# Altium schematic sheet sdc_Sch.SchDoc
size A4
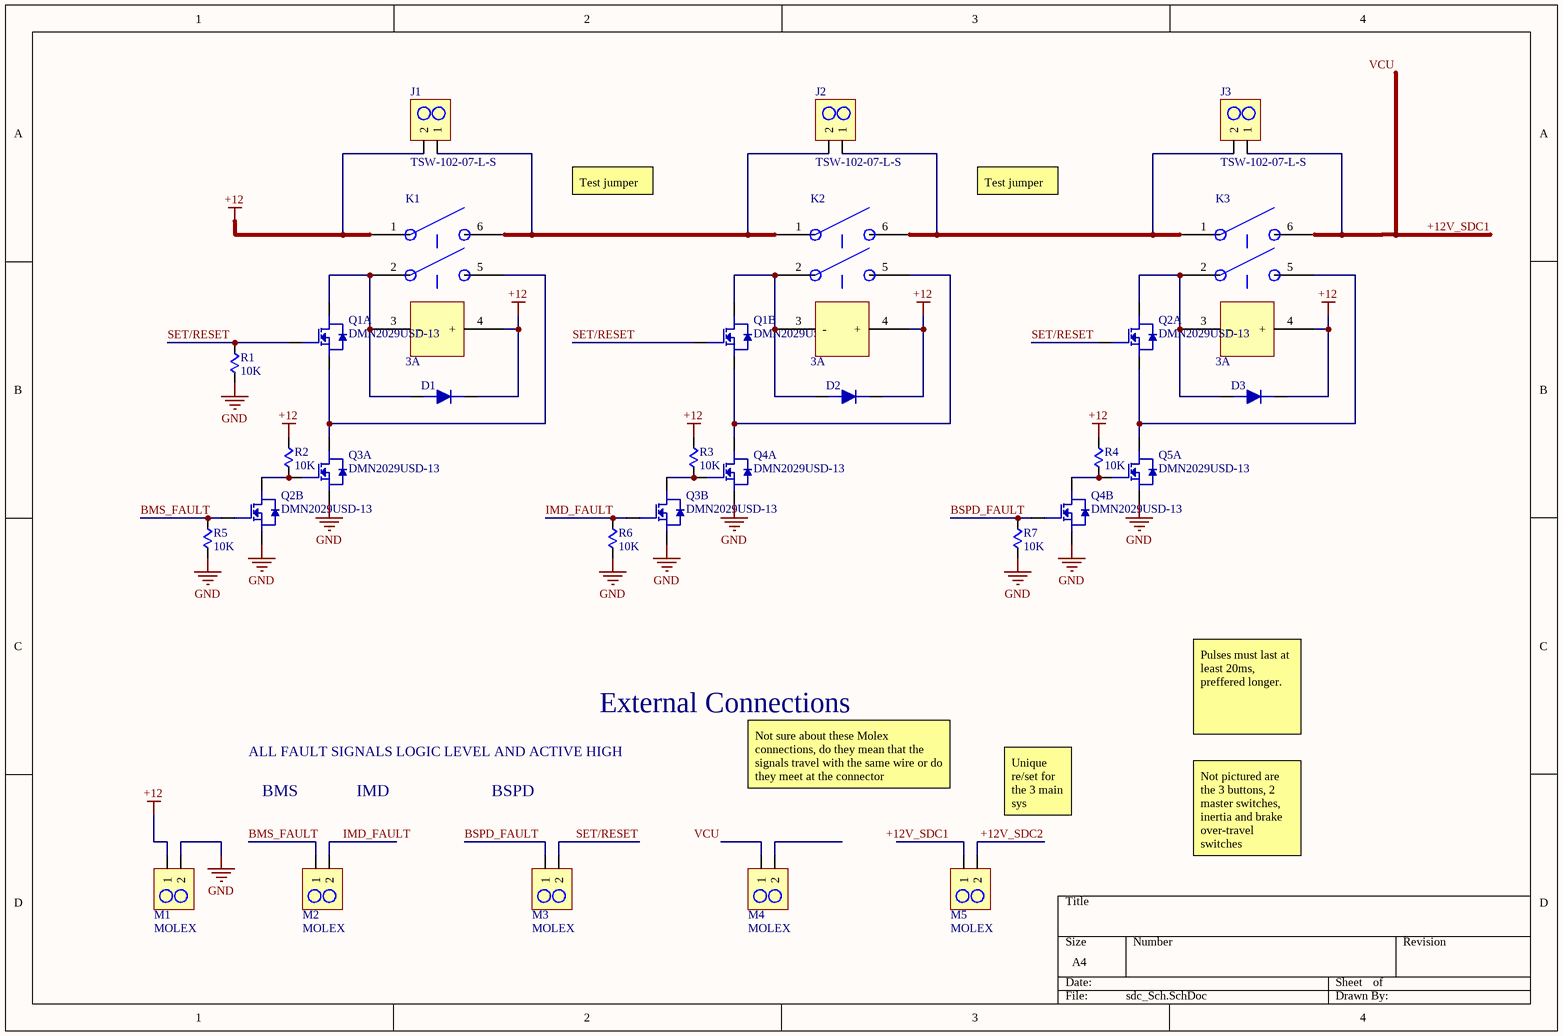
[diagram p0: sdc_Sch.SchDoc]

## Parts
D1  SD560BTR  [DIOM4436X26N]  (value not drawn)
D2  SD560BTR  [DIOM4436X26N]  (value not drawn)
D3  SD560BTR  [DIOM4436X26N]  (value not drawn)
J1  TSW-102-07-L-S  [TSW-102-XX-X-S]
J2  TSW-102-07-L-S  [TSW-102-XX-X-S]
J3  TSW-102-07-L-S  [TSW-102-XX-X-S]
K1  3A  [RELAY02_FOOTPRINT]
K2  3A  [RELAY02_FOOTPRINT]
K3  3A  [RELAY02_FOOTPRINT]
M1  MOLEX  [MOLEX 1]
M2  MOLEX  [MOLEX 1]
M3  MOLEX  [MOLEX 1]
M4  MOLEX  [MOLEX 1]
M5  MOLEX  [MOLEX 1]
Q1  DMN2029USD-13  [SOIC127P600X175-8N]  (parts A,B of 2)
Q2  DMN2029USD-13  [SOIC127P600X175-8N]  (parts A,B of 2)
Q3  DMN2029USD-13  [SOIC127P600X175-8N]  (parts A,B of 2)
Q4  DMN2029USD-13  [SOIC127P600X175-8N]  (parts A,B of 2)
Q5  DMN2029USD-13  [SOIC127P600X175-8N]  (part A of 2)
R1  10K  [10KOHM]
R2  10K  [10KOHM]
R3  10K  [10KOHM]
R4  10K  [10KOHM]
R5  10K  [10KOHM]
R6  10K  [10KOHM]
R7  10K  [10KOHM]

## Nets
+12: D1.2 D2.2 D3.2 J1.2 K1.1 K1.4(+) K2.4(+) K3.4(+) M1.1 R2.1 R3.1 R4.1
GND: M1.2 Q2.3(S2) Q3.1(S1) Q3.3(S2) Q4.1(S1) Q4.3(S2) Q5.1(S1) R1.2 R5.2 R6.2 R7.2
+12V_SDC1: J3.1 K3.6 M4.1 M5.1  [also labelled VCU]
+12V_SDC2: M5.2
BMS_FAULT: M2.1 Q2.4(G2) R5.1
BSPD_FAULT: M3.1 Q4.4(G2) R7.1
IMD_FAULT: M2.2 Q3.4(G2) R6.1
SET/RESET: M3.2 Q1.2(G1) Q1.4(G2) Q2.2(G1) R1.1
NetD1_1: D1.1 K1.2 K1.3(-) Q1.8(D1)
NetD2_1: D2.1 K2.2 K2.3(-) Q1.5(D2)
NetD3_1: D3.1 K3.2 K3.3(-) Q2.8(D1)
NetJ1_1: J1.1 J2.2 K1.6 K2.1
NetJ2_1: J2.1 J3.2 K2.6 K3.1
NetK1_5: K1.5 Q1.1(S1) Q3.8(D1)
NetK2_5: K2.5 Q1.3(S2) Q4.8(D1)
NetK3_5: K3.5 Q2.1(S1) Q5.8(D1)
NetQ2_5: Q2.5(D2) Q3.2(G1) R2.2
NetQ3_5: Q3.5(D2) Q4.2(G1) R3.2
NetQ4_5: Q4.5(D2) Q5.2(G1) R4.2

Not connected (* = marked no-connect by the designer): M4 2

## Notes on the sheet
- Test jumper
- External Connections
- ALL FAULT SIGNALS LOGIC LEVEL AND ACTIVE HIGH
- Not sure about these Molex connections, do they mean that the signals travel with the same wire or do they meet at the connector
- Pulses must last at least 20ms, preffered longer.
- BMS
- IMD
- BSPD
- Unique re/set for the 3 main sys
- Not pictured are the 3 buttons, 2 master switches, inertia and brake over-travel switches

## Library data of the parts
D1-D3 = SD560BTR: DIODE GEN PURP 600V 5A SMB; Manufacturer: SMC; Supplier 1: Digi-Key; Manufacturer Part Number: SD560BTR; Stock 1: 109105; Pricing 1: 1=0.5, 10=0.358, 100=0.2106, 500=0.11922, 1000=0.0914 (USD); Mount: Surface Mount; Case/Package: SMB; Packaging: Tape and Reel; Max Reverse Voltage (DC): 600V; Average Rectified Current: 5A; Supplier Part Number 1: 1655-1530-1-ND
J1-J3 = TSW-102-07-L-S: CONN HEADER VERT 2POS 2.54MM; Manufacturer: Samtec; Max Current Rating: 7.6A; Number of Positions: 2; Max Voltage Rating (AC): 550V; Gender: Male; Connector Type: Male Pin; Supplier 1: Digi-Key; Manufacturer Part Number: TSW-102-07-L-S; Stock 1: 176; Pricing 1: 1=0.22, 10=0.211, 25=0.1796, 50=0.1572, 100=0.146, 250=0.12916, 500=0.12356 (USD); Mount: Through Hole; Contact Material: Bronze; Contact Plating: Gold; Color: Black; Housing Color: Black; Housing Material: Polyester; Min Operating Temperature: -55°C; Max Operating Temperature: 125°C; Number of Rows: 1; Packaging: Bulk; Termination: Solder; Number of Contacts: 2; Orientation: Straight; Current Rating: 7.6A; Voltage Rating: 550V; Package Quantity: 1; Length: 5.08mm; Pitch: 2.54mm; Contact Mating Length: 0.23inch; Depth: 2.54mm; Width: 2.54mm; Radiation Hardening: No; REACH SVHC: No SVHC; Lead Free: Lead Free; ComponentLink1URL: http://suddendocs.samtec.com/prints/tsw-xxx-xx-x-x-xx-xxx-footprint.pdf?src-supplier=Avnet; ComponentLink1Description: http://suddendocs.samtec.com/prints/tsw-xxx-xx-x-x-xx-xxx-footprint.pdf?src-supplier=Avnet; ComponentLink2URL: http://suddendocs.samtec.com/prints/tsw-xxx-xx-x-x-xx-xxx-footprint.pdf?src-supplier=Avnet+Europe; ComponentLink2Description: http://suddendocs.samtec.com/prints/tsw-xxx-xx-x-x-xx-xxx-footprint.pdf?src-supplier=Avnet+Europe; ComponentLink3URL: http://suddendocs.samtec.com/prints/tsw-xxx-xx-x-x-xx-xxx-footprint.pdf?src-supplier=Digi-Key; ComponentLink3Description: http://suddendocs.samtec.com/prints/tsw-xxx-xx-x-x-xx-xxx-footprint.pdf?src-supplier=Digi-Key; ComponentLink4URL: http://www.farnell.com/datasheets/1596380.pdf?src-supplier=Element14; ComponentLink4Description: http://www.farnell.com/datasheets/1596380.pdf?src-supplier=Element14; Supplier Part Number 1: SAM1031-02-ND
K1-K3 = OSA-SS-212DM3,000: RELAY TE CONNECTIVITY / OEG         OSA-SS-212DM3,000             General Purpose Relay, OSA Series, Power, Non Latching, DPST-NO, 12 VDC, 3 A; Coil Current: 45mA; Throw Configuration: DPST; Operate Time: 20ms; Release Time: 10ms; Coil Power: 600mW; Coil Resistance: 270R; Coil Type: Non-Latching; Coil Voltage (DC): 12V; Contact Voltage Rating (AC): 240V; Supplier 1: Digi-Key; Supplier Part Number 1: OSA-SS-212DM3,000-ND; Manufacturer: TE Connectivity; Manufacturer Part Number: OSA-SS-212DM3,000; Stock 1: 2623; Pricing 1: 1=2.54, 10=2.385, 25=2.1204, 50=2.0142, 100=1.9083, 250=1.69624, 500=1.59022, 1000=1.48421, 5000=1.4312 (USD); Mount: Through Hole; Weight: 13g; Contact Material: Silver; Min Operating Temperature: -30°C; Max Operating Temperature: 60°C; Package Quantity: 1000; Packaging: Box; Contact Current Rating: 3A; Termination: PCB; Relay Type: General Purpose; Length: 24.4mm; Height: 0.976inch; Width: 12.9mm; REACH SVHC: Unknown; ELV: Compliant; ComponentLink1URL: http://www.farnell.com/datasheets/1652820.pdf?src-supplier=Farnell; ComponentLink1Description: http://www.farnell.com/datasheets/1652820.pdf?src-supplier=Farnell; ComponentLink2URL: http://www.farnell.com/cad/1652820.pdf?src-supplier=Element14; ComponentLink2Description: http://www.farnell.com/cad/1652820.pdf?src-supplier=Element14; ComponentLink3URL: http://www.te.com/commerce/DocumentDelivery/DDEController?Action=srchrtrv&DocNm=5-1419124-6&DocType=Customer+Drawing&DocLang=English&src-supplier=Digi-Key; ComponentLink3Description: http://www.te.com/commerce/DocumentDelivery/DDEController?Action=srchrtrv&DocNm=5-1419124-6&DocType=Customer+Drawing&DocLang=English&src-supplier=Digi-Key
M1-M5 = 43650-0200: MOLEX - 43650-0200 - CONNECTOR, HEADER, 2POS, 1ROW, 3MM; Contact Resistance: 10mR; Number of Positions: 2; Connector Type: Plug,Socket; Current Rating: 5A; Voltage Rating (AC): 250V; Voltage Rating: 600V; Gender: Male; Insulation Resistance: 1GR; Glow Wire Compliant: Compliant; Supplier 1: Avnet; Manufacturer: Molex; Manufacturer Part Number: 43650-0200; Stock 1: 0; Pricing 1: 1=0.39494, 10=0.36394, 25=0.34123, 50=0.33065, 100=0.32119 (USD); Mount: Through Hole; Contact Plating: Tin; Contact Material: Brass,Tin; Color: Black; Housing Color: Black; Housing Material: Thermoplastic; Min Operating Temperature: -40°C; Max Operating Temperature: 105°C; Number of Rows: 1; Packaging: Tray; Termination: Solder; Number of Contacts: 2; Orientation: Right Angle; Package Quantity: 3927; Working Voltage: 250V; Number of Circuits: 2; Voltage Rating (DC): 250V; Length: 9.65mm; Height: 5.57mm; Pitch: 3mm; Depth: 9.9mm; Radiation Hardening: No; Flammability Rating: UL94 V-0; REACH SVHC: Unknown; Halogen Free: Low Halogen; Lead Free: Lead Free; ComponentLink1URL: http://www.molex.com/webdocs/datasheets/pdf/en-us/0436500200_PCB_HEADERS.pdf?src-supplier=Avnet; ComponentLink1Description: http://www.molex.com/webdocs/datasheets/pdf/en-us/0436500200_PCB_HEADERS.pdf?src-supplier=Avnet; ComponentLink2URL: http://www.onlinecomponents.com/productFiles/mf-MOL/1029720436500200_pcb_headers.pdf?src-supplier=Onlinecomponents.com; ComponentLink2Description: http://www.onlinecomponents.com/productFiles/mf-MOL/1029720436500200_pcb_headers.pdf?src-supplier=Onlinecomponents.com; ComponentLink3URL: http://www.farnell.com/datasheets/1933359.pdf?src-supplier=Element14; ComponentLink3Description: http://www.farnell.com/datasheets/1933359.pdf?src-supplier=Element14; ComponentLink4URL: https://www.distrelec.biz/Web/Downloads/20/66/04402066.pdf?mime=application%2Fpdf&src-supplier=Distrelec; ComponentLink4Description: https://www.distrelec.biz/Web/Downloads/20/66/04402066.pdf?mime=application%2Fpdf&src-supplier=Distrelec; ComponentLink5URL: http://www.jameco.com/Jameco/Products/ProdDS/884053.pdf?src-supplier=Jameco; ComponentLink5Description: http://www.jameco.com/Jameco/Products/ProdDS/884053.pdf?src-supplier=Jameco; ComponentLink6URL: http://www.mouser.com/ds/2/276/0436500200_PCB_HEADERS-148844.pdf?src-supplier=Mouser; ComponentLink6Description: http://www.mouser.com/ds/2/276/0436500200_PCB_HEADERS-148844.pdf?src-supplier=Mouser; ComponentLink7URL: http://uk.rs-online.com/webdocs/13c3/0900766b813c3b7d.pdf?src-supplier=RSComponents; ComponentLink7Description: http://uk.rs-online.com/webdocs/13c3/0900766b813c3b7d.pdf?src-supplier=RSComponents; ComponentLink8URL: http://www.molex.com/webdocs/datasheets/pdf/en-us/0436500200_PCB_HEADERS.pdf?src-supplier=Avnet+Europe; ComponentLink8Description: http://www.molex.com/webdocs/datasheets/pdf/en-us/0436500200_PCB_HEADERS.pdf?src-supplier=Avnet+Europe; ComponentLink9URL: http://www.farnell.com/datasheets/1709823.pdf?src-supplier=Element14; ComponentLink9Description: http://www.farnell.com/datasheets/1709823.pdf?src-supplier=Element14; Supplier Part Number 1: 0436500200
Q1-Q5 = DMN2029USD-13: MOSFET 2N-CH 20V 5.8A 8SO; Manufacturer: Diodes; Rds On Max: 25mR; Input Capacitance: 1.171nF; Rise Time: 33.3ns; Max Power Dissipation: 1.2W; Turn-On Delay Time: 16.5ns; Turn-Off Delay Time: 119.3ns; Fall Time: 53.5ns; Drain to Source Resistance: 35mR; Gate to Source Voltage (Vgs): 8V; FET Type: 2 N-Channel; Supplier 1: Digi-Key; Supplier Part Number 1: DMN2029USD-13DICT-ND; Manufacturer Part Number: DMN2029USD-13; Stock 1: 1364; Pricing 1: 1=0.47, 10=0.397, 100=0.2974, 500=0.21812, 1000=0.16854 (USD); Mount: Surface Mount; Case/Package: SO; Number of Pins: 8; Min Operating Temperature: -55°C; Max Operating Temperature: 150°C; Package Quantity: 2500; Packaging: Tape and Reel; Continuous Drain Current (ID): 5.8A; Drain to Source Voltage (Vdss): 20V; Length: 4.95mm; Height: 1.5mm; Width: 3.95mm; Radiation Hardening: No; REACH SVHC: No SVHC; ComponentLink1URL: https://www.diodes.com/assets/Datasheets/DMN2029USD.pdf?src-supplier=Digi-Key; ComponentLink1Description: https://www.diodes.com/assets/Datasheets/DMN2029USD.pdf?src-supplier=Digi-Key
R1-R7 = RNCP0603FTD10K0: RES 10K OHM 1% 1/8W 0603; Manufacturer: Stackpole Electronics; Resistance: 10kR; Max Power Dissipation: 125mW; Temperature Coefficient: 100ppm/°C; Supplier 1: Digi-Key; Manufacturer Part Number: RNCP0603FTD10K0; Stock 1: 85524; Pricing 1: 1=0.1, 10=0.067, 100=0.0273, 1000=0.01224, 2500=0.01063 (USD); Mount: Surface Mount; Case/Package: 0603; Case Code (Metric): 1608; Case Code (Imperial): 0603; Contact Plating: Tin,Matte; Min Operating Temperature: -55°C; Max Operating Temperature: 155°C; Packaging: Tape and Reel; Tolerance: 1%; Composition: Thin Film; Number of Terminations: 2; Features: Moisture Resistant,Anti-Sulfur; Length: 0.059inch; Height: 0.02inch; Width: 0.031inch; Radiation Hardening: No; Lead Free: Lead Free; Supplier Part Number 1: RNCP0603FTD10K0DKR-ND